# EAGLE design recorder (EAGLE 6.5.0)
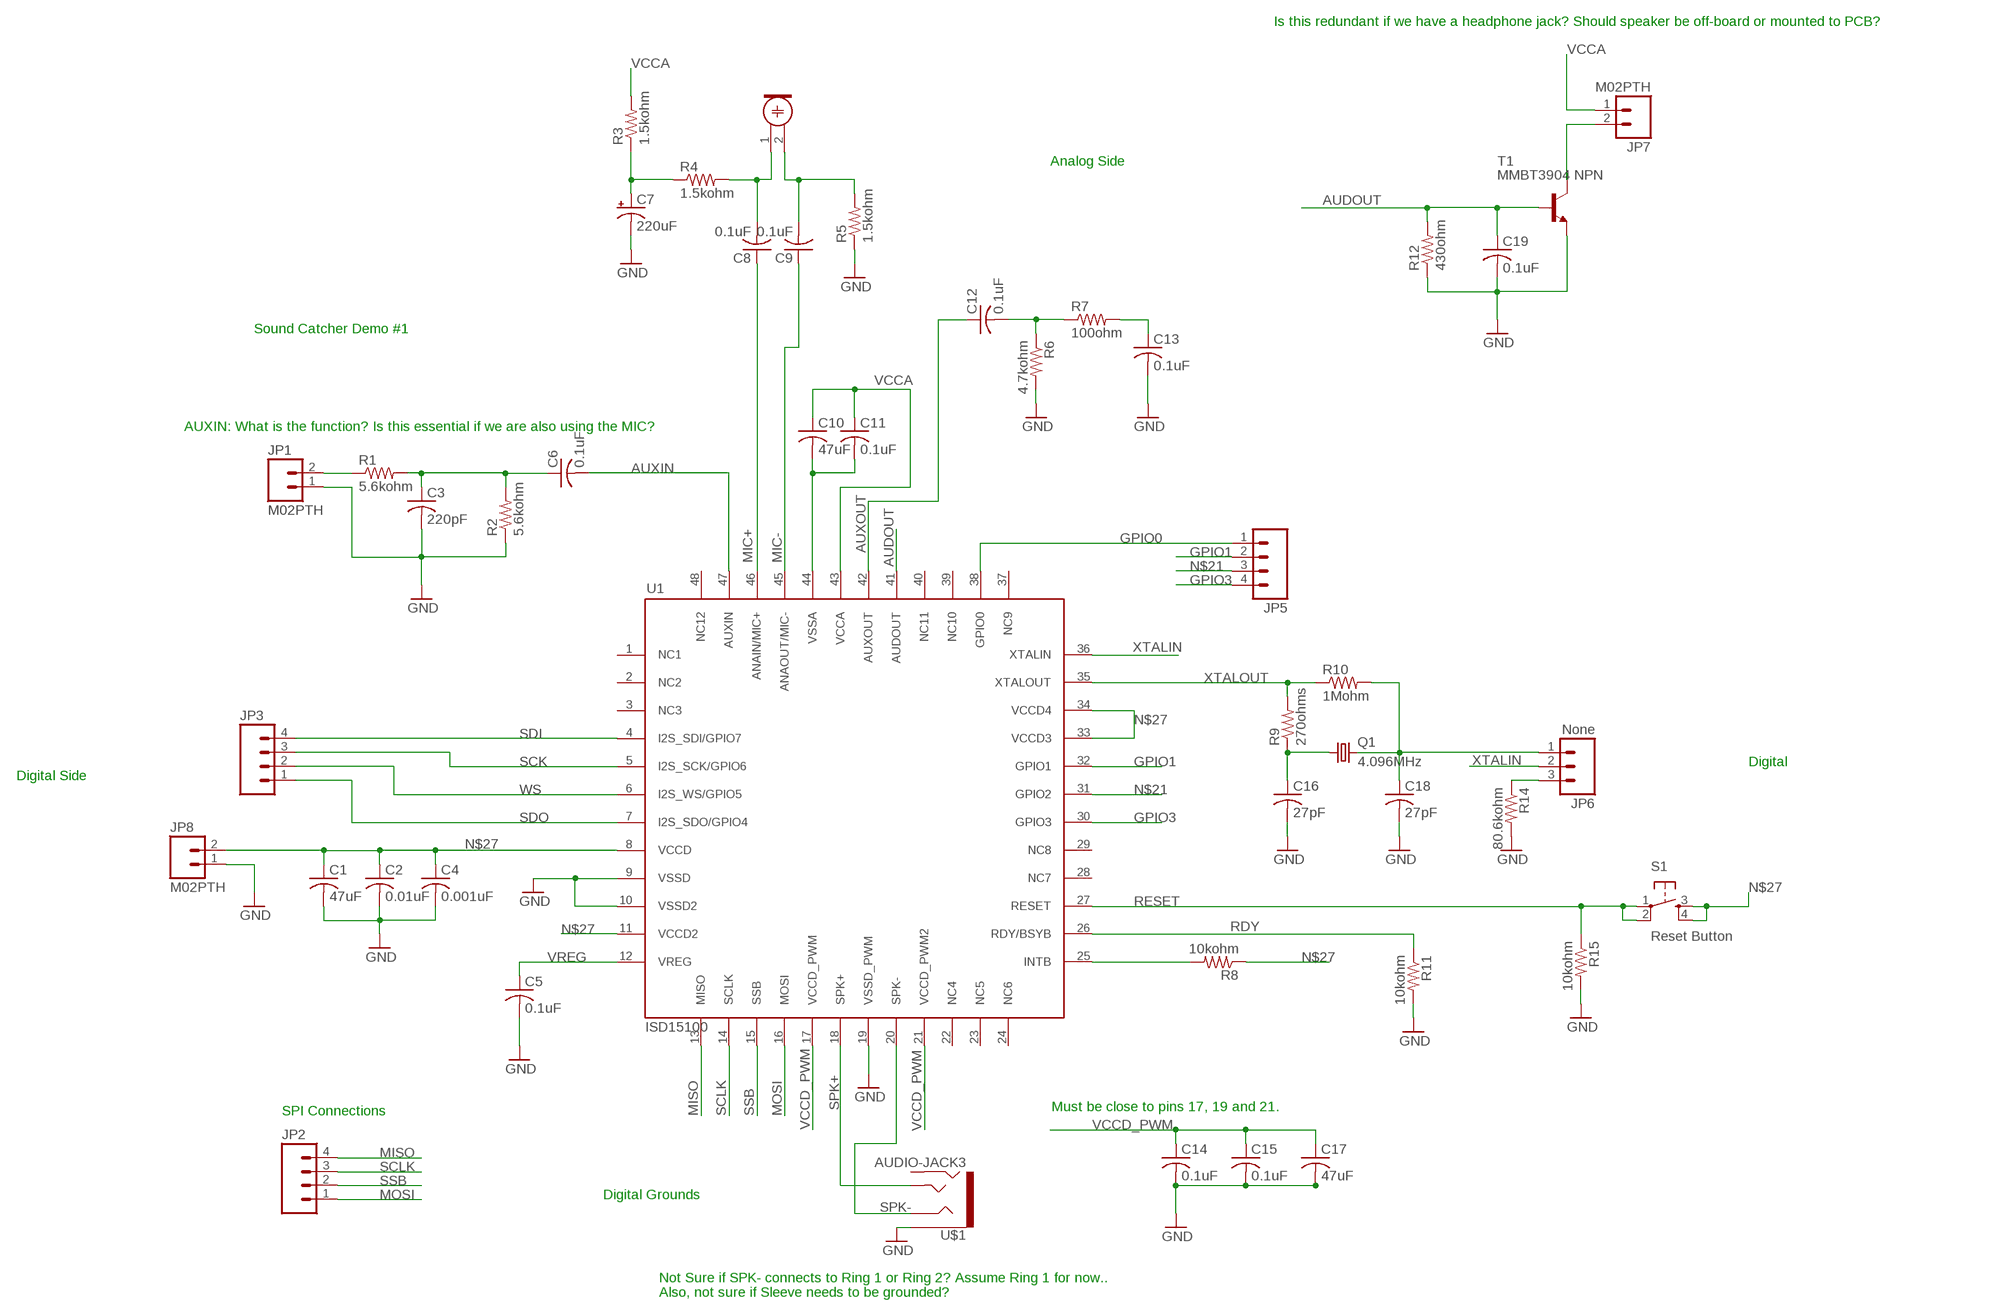
[diagram p0: schematic, sheet 1]

## Parts
C1  47uF  C-USC1206  [C1206]
C2  0.01uF  C-USC0402  [C0402]
C3  220pF  C-USC0402  [C0402]
C4  0.001uF  C-USC0402  [C0402]
C5  0.1uF  C-USC0402  [C0402]
C6  0.1uF  C-USC0603  [C0603]
C7  220uF  CPOL-US175TMP-0808  [175TMP-0808]
C8  0.1uF  C-USC0402  [C0402]
C9  0.1uF  C-USC0402  [C0402]
C10  47uF  C-USC1206  [C1206]
C11  0.1uF  C-USC0402  [C0402]
C12  0.1uF  C-USC0402  [C0402]
C13  0.1uF  C-USC0402  [C0402]
C14  0.1uF  C-USC0402  [C0402]
C15  0.1uF  C-USC0402  [C0402]
C16  27pF  C-USC0402  [C0402]
C17  47uF  C-USC1206  [C1206]
C18  27pF  C-USC0402  [C0402]
C19  0.1uF  C-USC0402  [C0402]
JP1  M02PTH  [1X02]
JP2  M04PTH  [1X04]
JP3  M04PTH  [1X04]
JP5  M04PTH  [1X04]
JP6  None  M03PTH  [1X03]
JP7  M02PTH  [1X02]
JP8  M02PTH  [1X02]
M1  ELECTRET_MICROPHON-WM-61A  [WM-61A]
Q1  4.096MHz  CRYSTALSM49  [SM49]
R1  5.6kohm  R-US_R0402  [R0402]
R2  5.6kohm  R-US_R0402  [R0402]
R3  1.5kohm  R-US_R0201  [R0201]
R4  1.5kohm  R-US_R0201  [R0201]
R5  1.5kohm  R-US_R0201  [R0201]
R6  4.7kohm  R-US_R0201  [R0201]
R7  100ohm  R-US_R0201  [R0201]
R8  10kohm  R-US_R0201  [R0201]
R9  270ohms  R-US_R0201  [R0201]
R10  1Mohm  R-US_R0201  [R0201]
R11  10kohm  R-US_R0201  [R0201]
R12  430ohm  R-US_R0402  [R0402]
R14  80.6kohm  R-US_R0402  [R0402]
R15  10kohm  R-US_R0201  [R0201]
S1  Reset Button  TAC_SWITCHSMD  [TACTILE-SWITCH-SMD]
T1  MMBT3904 NPN  MMBT3904LT1-NPN-SOT23-BEC  [SOT23-BEC]
U1  ISD15100  [LQFP48]
U$1  AUDIO-JACK3  [AUDIO-JACK-TRRS-SMD]

## Nets
AUDOUT: C19.1 R12.2 T1.B U1.41(AUDOUT)
AUXIN: C6.2 U1.47(AUXIN)
AUXOUT: C12.1 U1.42(AUXOUT)
GND: C1.2 C2.2 C3.2 C4.2 C5.2 C7.- C13.2 C14.2 C15.2 C16.2 C17.2 C18.2 C19.2 JP1.1 JP8.1 R2.1 R5.1 R6.2 R11.2 R12.1 R14.2 R15.2 T1.E U1.9(VSSD) U1.10(VSSD2) U1.19(VSSD_PWM) U$1.EARTH
GPIO0: JP5.1 U1.38(GPIO0)
GPIO1: JP5.2 U1.32(GPIO1)
GPIO3: JP5.4 U1.30(GPIO3)
MIC+: C8.1 U1.46(ANAIN/MIC+)
MIC-: C9.1 U1.45(ANAOUT/MIC-)
MISO: JP2.4 U1.13(MISO)
MOSI: JP2.1 U1.16(MOSI)
N$1: C18.1 JP6.1 Q1.2 R10.2
N$2: C16.1 Q1.1 R9.1
N$3: C12.2 R6.1 R7.1
N$4: R8.2 U1.25(INTB)
N$5: JP1.2 R1.1
N$7: JP6.3 R14.1
N$9: C3.1 C6.1 R1.2 R2.2
N$13: JP7.2 T1.C
N$15: C9.2 M1.2 R5.2
N$17: C13.1 R7.2
N$19: C10.2 C11.2 U1.44(VSSA)
N$21: JP5.3 U1.31(GPIO2)
N$22: C8.2 M1.1 R4.2
N$27: C1.1 C2.1 C4.1 JP8.2 R8.1 S1.3 S1.4 U1.8(VCCD) U1.11(VCCD2) U1.33(VCCD3) U1.34(VCCD4)
N$28: C7.+ R3.1 R4.1
RDY: R11.1 U1.26(RDY/BSYB)
RESET: R15.1 S1.1 S1.2 U1.27(RESET)
SCK: JP3.3 U1.5(I2S_SCK/GPIO6)
SCLK: JP2.3 U1.14(SCLK)
SDI: JP3.4 U1.4(I2S_SDI/GPIO7)
SDO: JP3.1 U1.7(I2S_SDO/GPIO4)
SPK+: U1.18(SPK+) U$1.TIP
SPK-: U1.20(SPK-) U$1.RING1
SSB: JP2.2 U1.15(SSB)
VCCA: C10.1 C11.1 JP7.1 R3.2 U1.43(VCCA)
VCCD_PWM: C14.1 C15.1 C17.1 U1.17(VCCD_PWM) U1.21(VCCD_PWM2)
VREG: C5.1 U1.12(VREG)
WS: JP3.2 U1.6(I2S_WS/GPIO5)
XTALIN: JP6.2 U1.36(XTALIN)
XTALOUT: R9.2 R10.1 U1.35(XTALOUT)
Unconnected: U1.1(NC1) U1.2(NC2) U1.3(NC3) U1.22(NC4) U1.23(NC5) U1.24(NC6) U1.28(NC7) U1.29(NC8) U1.37(NC9) U1.39(NC10) U1.40(NC11) U1.48(NC12) U$1.RING2

## Notes on the sheet
- Is this redundant if we have a headphone jack? Should speaker be off-board or mounted to PCB?
- Analog Side
- Sound Catcher Demo #1
- AUXIN: What is the function? Is this essential if we are also using the MIC?
- Digital
- Digital Side
- Must be close to pins 17, 19 and 21.
- SPI Connections
- Digital Grounds
- Not Sure if SPK- connects to Ring 1 or Ring 2? Assume Ring 1 for now..
  Also, not sure if Sleeve needs to be grounded?

## Library data of the parts
C1-C6 C8-C19 = rcl:C-US: CAPACITOR, American symbol
C7 = rcl:CPOL-US: POLARIZED CAPACITOR, American symbol
JP1 JP7 JP8 = SparkFun-Connectors:M02: Standard 2-pin 0.1" header. Use with - straight break away headers ( PRT-00116) - right angle break away headers (PRT-00553) - swiss pins (PRT-00743) - machine pins (PRT-00117) - female headers (PRT-00115) Molex polarized connector foot print use with: PRT-08233 with associated crimp pins and housings. 2.54_SCREWTERM for use with PRT-10571. 3.5mm Screw Terminal footprints for PRT-08084 5mm Screw Terminal footprints for use with PRT-08433
JP2 JP3 JP5 = SparkFun-Connectors:M04: Header 4 Standard 4-pin 0.1" header. Use with straight break away headers (SKU : PRT-00116), right angle break away headers (PRT-00553), swiss pins (PRT-00743), machine pins (PRT-00117), and female headers (PRT-00115). Molex polarized connector foot print use with SKU : PRT-08231 with associated crimp pins and housings. 1MM SMD Version SKU: PRT-10208
JP6 = SparkFun-Connectors:M03: Header 3 Standard 3-pin 0.1" header. Use with straight break away headers (SKU : PRT-00116), right angle break away headers (PRT-00553), swiss pins (PRT-00743), machine pins (PRT-00117), and female headers (PRT-00115). Molex polarized connector foot print use with SKU : PRT-08232 with associated crimp pins and housings.
M1 = microphon:ELECTRET_MICROPHON-: Electret Condenser Microphone
Q1 = adafruit:CRYSTAL: CRYSTAL; OC_FARNELL: unknown; OC_NEWARK: unknown
R1 R2 R12 R14 = rcl:R-US_: RESISTOR, American symbol
R3-R11 R15 = rcl:R-US_: RESISTOR, American symbol; MF: AVX CORPORATION; MPN: 0402ZD104KAT2A; OC_NEWARK: 81C8514
S1 = SparkFun-Electromechanical:TAC_SWITCH: Momentary Switch Button commonly used for reset or general input. Spark Fun Electronics SKU : COM-00097 SMT- SWCH-08247
T1 = transistor:*-NPN-: NPN Transistror BF959 corrected 2008.03.06
U1 = mirans_library:ISD15100: Nuvoton Audio IC. 48 KHz max sampling rate. record/playback up to 2 min of audio.; OC_NEWARK: unknown
U$1 = SparkFun-Connectors:AUDIO-JACK3: Audio jack - 3.5mm TRRS variety - two rings.

## Board
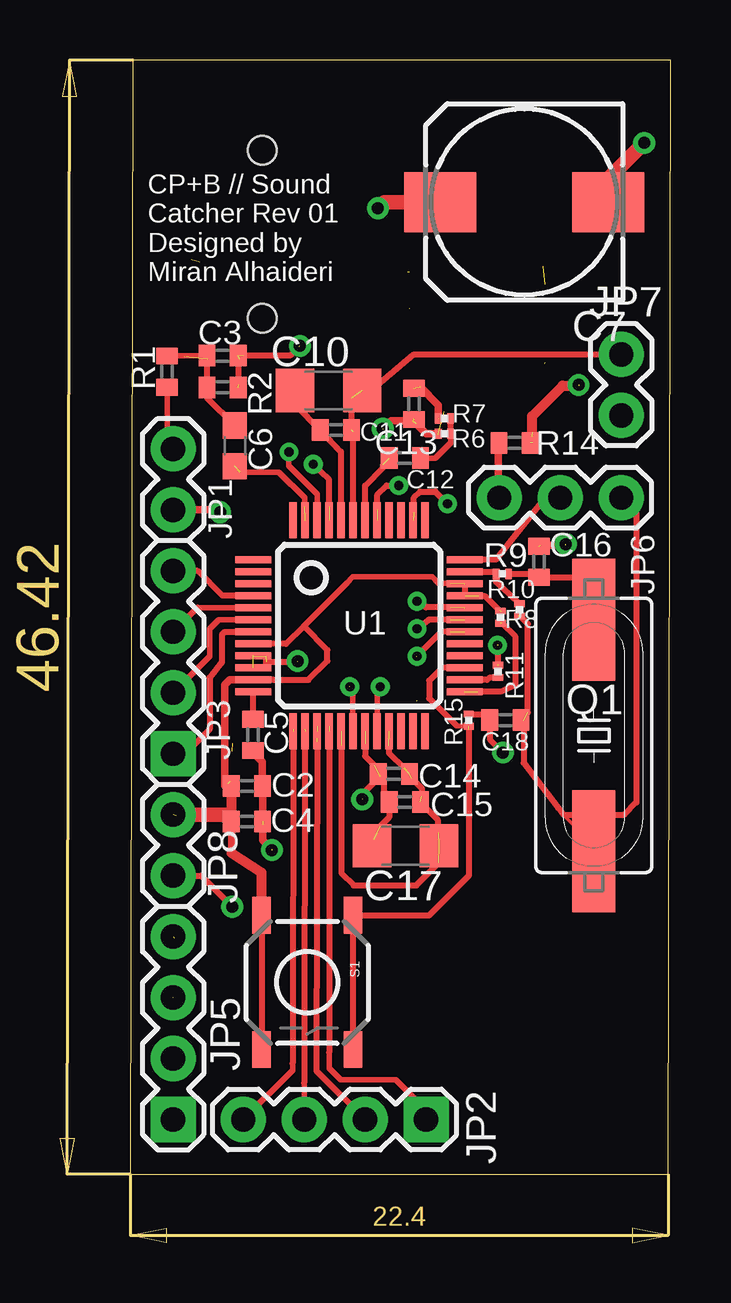
[diagram p1: board, top side]
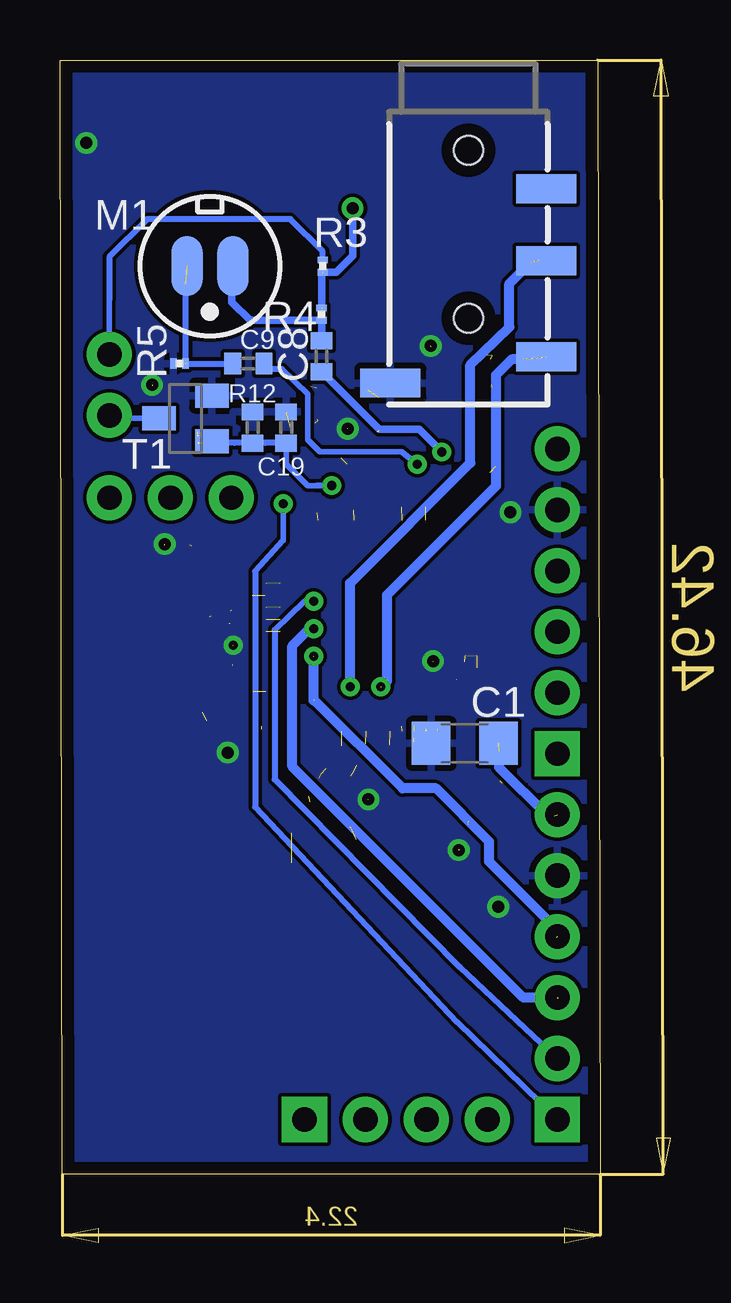
[diagram p2: board, bottom side, seen from below]

Size 22.51 x 46.43 mm. Coordinates in mm from the lower left corner, seen from the top.
Outline: 0,0 22.4,0 22.51,46.43 0.1,46.42 0,0
Copper layers (1*16): Top 0.0178mm / dielectric 59mil / Bottom 0.0178mm
Design rules "SSC-EAGLE-2Lyr_v1.0.0.3": minimum track width 6mil, minimum drill 14mil, track to track 6mil, track to pad 6mil, pad to pad 6mil, via to via 6mil, smd to smd 6mil, copper to edge 20mil, drill to drill 16mil, minimum pad ring 8mil, minimum via ring 8mil, stop-mask expansion 3mil, vias tented up to drill 0mil, thermal gap 10mil

### Footprints (pad centres in the part's own frame; a part is rotated, then mirrored left to right if it is on the bottom)
C1206 = smd 1.6 x 1.8: 1 -1.4,0; 2 1.4,0
C0402 = smd 0.7 x 0.9: 1 -0.65,0; 2 0.65,0
C0603 = smd 1.1 x 1: 1 -0.85,0; 2 0.85,0
175TMP-0808 = smd 3 x 2.5: + 3.5,0; - -3.5,0
1X02 = drill 1.016 pad 1.88: 1 0,0; 2 2.54,0
1X04 = drill 1.016 pad 1.88 square: 1 0,0 | drill 1.016 pad 1.88: 2 2.54,0; 3 5.08,0; 4 7.62,0
1X03 = drill 1.016 pad 1.88: 1 0,0; 2 2.54,0; 3 5.08,0
WM-61A = smd 2.5 x 1.3: 1 0,0.95; 2 0,-0.95
SM49 = smd 5.08 x 1.778: 1 -4.826,0; 2 4.826,0
R0402 = smd 0.7 x 0.9: 1 -0.65,0; 2 0.65,0
R0201 = smd 0.28 x 0.43: 1 -0.255,0; 2 0.255,0
TACTILE-SWITCH-SMD = smd 1.524 x 0.762: 1 -2.794,1.905; 2 2.794,1.905; 3 -2.794,-1.905; 4 2.794,-1.905
SOT23-BEC = smd 1 x 1.4: B -0.95,-1.1; C 0,1.1; E 0.95,-1.1
LQFP48 = smd 0.3 x 1.5: 1 -2.75,-4.4; 2 -2.25,-4.4; 3 -1.75,-4.4; 4 -1.25,-4.4; 5 -0.75,-4.4; 6 -0.25,-4.4; 7 0.25,-4.4; 8 0.75,-4.4; 9 1.25,-4.4; 10 1.75,-4.4; 11 2.25,-4.4; 12 2.75,-4.4; 25 2.75,4.4; 26 2.25,4.4; 27 1.75,4.4; 28 1.25,4.4; 29 0.75,4.4; 30 0.25,4.4; 31 -0.25,4.4; 32 -0.75,4.4; 33 -1.25,4.4; 34 -1.75,4.4; 35 -2.25,4.4; 36 -2.75,4.4 | smd 1.5 x 0.3: 13 4.4,-2.75; 14 4.4,-2.25; 15 4.4,-1.75; 16 4.4,-1.25; 17 4.4,-0.75; 18 4.4,-0.25; 19 4.4,0.25; 20 4.4,0.75; 21 4.4,1.25; 22 4.4,1.75; 23 4.4,2.25; 24 4.4,2.75; 37 -4.4,2.75; 38 -4.4,2.25; 39 -4.4,1.75; 40 -4.4,1.25; 41 -4.4,0.75; 42 -4.4,0.25; 43 -4.4,-0.25; 44 -4.4,-0.75; 45 -4.4,-1.25; 46 -4.4,-1.75; 47 -4.4,-2.25; 48 -4.4,-2.75
AUDIO-JACK-TRRS-SMD = smd 1.2 x 2.5: EARTH 11.3,-3.25; RING1 6.2,3.25; RING2 3.2,3.25; TIP 10.2,3.25 | hole 1.2: 1.6,0; 8.6,0

### Placement (x,y rotation side)
C1  5.64,17.96 180 bottom
C2  4.85,16.18 0 top
C3  3.84,32.79 0 top
C4  4.85,14.71 0 top
C5  5.11,18.31 270 top
C6  4.34,30.35 270 top
C7  16.41,40.51 180 top
C8  11.61,34.09 90 bottom
C9  14.66,33.78 180 bottom
C10  8.26,32.66 180 top
C11  8.56,31.01 180 top
C12  11.43,29.84 0 top
C13  11.81,32.11 270 top
C14  10.97,16.69 180 top
C15  11.43,15.52 180 top
C16  17.02,25.53 90 top
C17  11.46,13.69 180 top
C18  15.62,18.92 180 top
C19  13.08,31.12 90 bottom
JP1  1.78,27.69 90 top
JP2  12.32,2.29 180 top
JP3  1.78,17.53 90 top
JP5  1.78,2.29 90 top
JP6  20.45,28.19 180 top
JP7  20.45,34.16 270 top
JP8  1.78,12.45 90 top
M1  16.26,37.85 270 bottom
Q1  19.3,18.29 270 top
R1  1.52,33.45 90 top
R2  3.84,34.11 180 top
R3  11.56,37.85 90 bottom
R4  11.61,35.84 270 bottom
R5  17.53,33.78 0 bottom
R6  13.08,30.86 180 top
R7  13.08,31.5 180 top
R8  15.42,23.22 270 top
R9  15.49,25.02 180 top
R10  16.21,23.52 270 top
R11  15.32,20.95 90 top
R12  14.48,31.12 270 bottom
R14  16,30.48 0 top
R15  14.1,18.92 90 top
S1  7.37,8 270 top
T1  17.27,31.5 90 bottom
U1  9.53,22.86 270 top
U$1  5.49,44.27 270 bottom

### Tracks (layer width: path | path; a pad name or v marks a point on that pad's centre or on a via)
AUDOUT  (via drill 0.38)  (1 unrouted)
  Top 0.254: 10.29,27.69 10.29,28.32 10.67,28.7 v11.18,28.7
  Bottom 0.152: 13.97,30.48 15.24,30.48
  Bottom 0.229: 11.81,28.7 12.19,28.7 13.08,29.59 C19.1
  Bottom 0.254: R12.2 13.97,30.48 13.1,30.48 C19.1 | R12.2 14.49,30.48 15.24,30.48 15.49,30.48 15.56,30.55 T1.B | v11.18,28.7 11.81,28.7
AUXIN  (2 unrouted)
  Top 0.229: 4.57,29.25 6.18,29.25 7.26,28.19 7.26,27.81
AUXOUT  (1 unrouted)
  Top 0.254: U1.42 9.78,28.7 10.54,29.46 10.54,29.59
GND  (via drill 0.38, 0.5)  (27 unrouted)
  Top 0.152: 10.16,13.97 C17.2
  Top 0.254: 10.41,14.5 10.78,14.87 C15.2 10.78,15.74 10.57,15.95 10.57,16.44 C14.2 | R15.2 14.72,19.18 C18.2 14.97,18.12 v15.52,17.58 | JP8.1 2.95,12.45 v4.24,11.15 | 5.66,21.36 6.96,21.36 | 5.64,21.59 5.64,21.13 | 9.78,17.93 9.78,17.42 10.16,17.04 | 10.41,16.59 9.68,15.85 9.68,15.62 | 16.76,30.48 16.76,30.91 | 4.7,34.14 6.68,34.14 7.04,34.49 | 4.52,32.89 4.52,33.93 4.55,33.96 | 15.32,21.23 15.32,22.05
  Top 0.305: C5.2 5.11,17.58 5.49,17.2 5.49,16.2 C2.2 C4.2 | 5.89,13.54 5.51,13.92 5.51,14.58 | 12.8,30.86 12.32,30.86 11.89,31.29 | 10.54,31.06 10.87,31.39 11.76,31.39 | JP1.1 3.58,27.69 3.71,27.56 | 17.09,26.21 18.14,26.21
  Top 0.406: 16.74,30.76 16.74,31.6 18.01,32.87 18.67,32.87
  Top 0.61: C7.- 19.91,41.47 v21.41,42.98
  other vias: 18.67,32.89 10.52,31.06 3.73,27.58 18.14,26.26 7.06,34.52 15.29,22.05 6.96,21.39 9.65,15.62 5.89,13.51
  pour Bottom: 0,0 22.89,0 22.89,46.38 0,46.38
GPIO0  (via drill 0.38)  (1 unrouted)
  Top 0.254: 11.81,27.56 11.81,28.19 12.06,28.45 12.7,28.45 v13.21,27.94
  Bottom 0.229: v13.21,27.94 13.21,26.42
  Bottom 0.254: JP5.1 5.97,6.35 14.38,15.32 14.38,25.12 13.21,26.42
GPIO1  (via drill 0.38)  (1 unrouted)
  Top 0.254: 13.33,23.62 12.32,23.62 v11.94,23.88
  Bottom 0.254: v11.94,23.88 12.32,23.88 13.56,22.68 13.56,16.46 5.84,8.64 JP5.2
GPIO3  (via drill 0.38)  (4 unrouted)
  Top 0.254: 13.33,22.61 12.95,22.61 v11.94,21.59
  Bottom 0.406: 11.94,19.74 11.94,21.56 | 1.83,9.85 1.83,10.24 4.62,13.03 4.62,13.87 6.83,16.08 8.23,16.08 11.91,19.76
MIC+  (via drill 0.38)
  Top 0.229: v6.6,30.1 6.6,29.52 7.77,28.35 7.77,27.29
  Top 0.254: U1.46 7.77,27.29
  Bottom 0.305: v6.6,30.1 7.54,31.04 9.21,31.04 C8.1
MIC-  (via drill 0.38)  (1 unrouted)
  Top 0.254: 8.28,27.81 8.28,28.96 v7.62,29.59
  Bottom 0.229: 8.26,30.1 11.68,30.1 12.19,30.61 12.19,32.51
  Bottom 0.254: 8.26,30.1 v7.62,29.59 | 12.19,32.51 13.26,33.55 13.78,33.55 C9.1
MISO  (1 unrouted)
  Top 0.229: 6.76,4.62 6.76,4.34 JP2.4
  Top 0.254: 6.78,18.54 6.76,4.62
MOSI  (1 unrouted)
  Top 0.229: 8.28,5.08 8.28,4.42 8.76,3.94 11.05,3.94 12.32,2.67 JP2.1
  Top 0.254: 8.28,18.67 8.28,5.08
N$1  (2 unrouted)
  Top 0.152: Q1.2 19.05,13.97 17.78,15.24 17.82,15.27
  Top 0.254: C18.1 16.38,18.91 16.38,17.15 17.82,15.27 18.03,14.99 20.57,14.99 21.08,15.49 21.08,27.56 JP6.1 | 19.43,13.46 Q1.2 19.3,14.99 | 16.56,19.25 16.56,22.94 16.26,23.24
N$2
  Top 0.254: Q1.1 18.92,23.49 18.92,25.15 18.65,24.88 C16.1 16.88,25.02 R9.1
N$3
  Top 0.229: R6.1 13.34,30.48 12.7,29.84 C12.2
  Top 0.254: R6.1 R7.1
N$4  (2 unrouted)
  Top 0.254: 15.47,22.96 16.03,22.43 16.03,20.4 15.42,20.12 14.48,20.12
N$5
  Top 0.229: JP1.2 1.52,30.48 R1.1
N$7
  Top 0.152: R14.1 15.24,30.48 15.24,27.94 JP6.3
  Top 0.254: JP6.3 15.37,30.35
N$9
  Top 0.229: R1.2 R2.2
  Top 0.254: R2.2 C3.1 3.19,32.36 C6.1
N$13
  Bottom 0.229: T1.C 20.32,31.5 JP7.2
N$15  (2 unrouted)
  Bottom 0.254: R5.2 C9.2 | 17.27,33.81 17.27,37.08
N$17  (2 unrouted)
  Top 0.305: R7.2 12.83,32.05 12.06,32.82
N$19
  Top 0.254: U1.44 8.78,30.07 C11.2 | C11.2 8.76,30.11 | C10.2 6.86,32.07 C11.2
N$21  (via drill 0.38)  (2 unrouted)
  Top 0.254: v11.94,22.73 12.45,23.11 13.33,23.11
  Bottom 0.254: v11.94,22.73 11.96,22.73
  Bottom 0.406: 1.75,7.37 3.2,7.37 12.83,16.99 12.83,22.02 12.09,22.76 11.99,22.76 11.96,22.73
N$22
  Bottom 0.152: 15.24,36.83 M1.1
  Bottom 0.305: C8.2 R4.2 14.58,35.58 15.34,36.35 15.34,36.73 15.24,36.83
N$27  (7 unrouted)
  Top 0.229: 9.02,24.64 9.27,24.89 12.57,24.89 12.83,24.64 13.33,24.64
  Top 0.254: 5.99,20.6 7.42,20.6 8.2,21.39 8.2,21.84 7.21,22.84 | U1.34 U1.33 | U1.33 13.94,24.1 | U1.33 13.9,24.13 13.72,24.13 | S1.3 S1.4 | 9.02,24.64 7.21,22.84 | 7.21,22.84 6.48,22.1 5.14,22.1 U1.8 | 4.07,16.29 4.09,16.26 | 5.97,20.6 5.16,20.6 U1.11 | C2.1 4.16,16.38 | 14.5,24.1 14.76,24.1 15.37,23.49
  Top 0.305: 5.16,20.6 4.14,20.6 3.94,20.4 3.94,16.19 C2.1 | 4.22,13.39 4.22,14.69 C4.1
  Top 0.406: S1.3 5.46,12.57 4.22,13.39 | C2.1 C4.1
  Top 0.61: JP8.2 3.92,14.99 C4.1
  Bottom 0.406: 4.22,17.63 4.22,16.97 2.18,14.94 1.91,14.94
N$28  (via drill 0.5)  (2 unrouted)
  Top 0.152: 12.7,40.64 C7.+
  Top 0.61: C7.+ 10.57,40.51 v10.31,40.26
  Bottom 0.305: v10.31,40.26 10.31,38.28 11,37.59 R3.1 | 11.61,36.07 11.61,37.59
RDY
  Top 0.254: R11.1 14.99,20.7 14.86,20.6 13.96,20.6 U1.26
RESET  (1 unrouted)
  Top 0.229: R15.1 13.59,18.69 12.45,19.84
  Top 0.254: U1.27 12.98,21.11 12.45,20.57 12.45,19.84 | S1.2 S1.1 12.45,10.79 14.1,12.45 14.1,18.54
SCK
  Top 0.229: U1.5 2.78,23.61
  Top 0.254: 2.78,23.61 JP3.3
SCLK  (1 unrouted)
  Top 0.229: 7.24,3.81 JP2.3
  Top 0.254: 7.26,18.54 7.24,3.81
SDI
  Top 0.254: U1.4 3.83,24.11 2.79,25.15 JP3.4
SDO
  Top 0.254: JP3.1 2.29,17.53 3.3,18.54 3.3,20.7 3.81,21.34 3.81,22.48 3.94,22.61 U1.7
SPK+  (via drill 0.38)  (2 unrouted)
  Top 0.229: U1.18 9.27,20.19 v9.14,20.32
  Top 0.254: U1.18
  Bottom 0.406: 3.23,33.96 3.68,33.96 4.34,33.3 4.34,28.68 8.89,24.13 8.89,20.55 9.12,20.32
SPK-  (via drill 0.38)  (1 unrouted)
  Top 0.229: 10.29,18.47 10.29,20.19 v10.41,20.32
  Top 0.254: U1.20 10.29,18.47
  Bottom 0.152: 2.54,38.1 U$1.RING1
  Bottom 0.406: v10.41,20.32 10.41,24.64 5.41,29.64 5.41,33.73 3.79,35.31 3.79,37.11 2.9,38
SSB  (2 unrouted)
  Top 0.229: 7.75,4.32 JP2.2
  Top 0.254: 7.77,18.03 7.75,4.32 | 7.77,18.67 7.77,18.16
VCCA  (2 unrouted)
  Top 0.254: C10.1 10.16,32.77 11.81,34.16 JP7.1 | U1.43 9.28,30.95 | C11.1 9.21,32.35 9.22,32.36
  Bottom 0.229: R3.2 | 20.45,34.92 20.45,36.45
  Bottom 0.254: 20.45,34.92 JP7.1 | R3.2 11.56,38.46 12.9,39.8 18.87,39.8 20.45,38.23 20.45,36.45
VCCD_PWM  (7 unrouted)
  Top 0.254: C15.1 12.08,15.5 12.8,14.78 12.8,14.28 12.85,14.22 | 8.79,17.88 8.79,12.55 9.3,12.04 11.91,12.04 12.85,12.98 | 10.77,17.86 10.77,17.55 11.4,16.92 | 11.71,16.51 12.14,16.08 12.14,15.75
VREG
  Top 0.254: C5.1 5.11,20.09 U1.12
WS
  Top 0.229: U1.6 3.68,23.11 3.3,22.73 3.3,21.59
  Top 0.254: 3.3,21.59 JP3.2
XTALIN
  Top 0.254: U1.36 13.97,25.63 15.24,25.63 17.27,28.19 JP6.2
XTALOUT
  Top 0.254: U1.35 15.15,25.11 R9.2 15.24,24.69 15.47,24.46 15.49,24.44 R10.1

### Text on the board
tPlace: CP+B // Sound / Catcher Rev 01 / Designed by / Miran Alhaideri